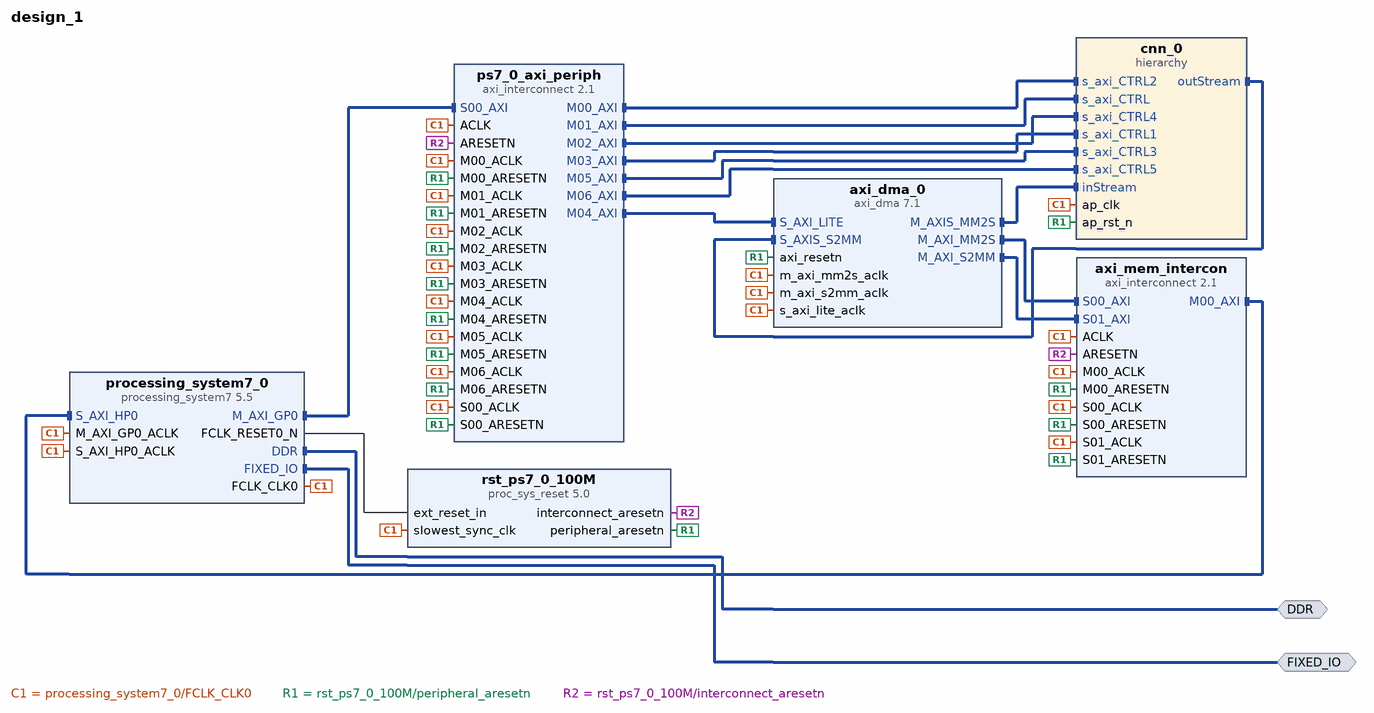
[diagram p0: block diagram of the top level]
# Vivado block design design_1, xc7z020clg484-1, Vivado 2016.4
create_bd_design design_1

create_bd_intf_port -mode Master -vlnv xilinx.com:interface:ddrx_rtl:1.0 DDR
create_bd_intf_port -mode Master -vlnv xilinx.com:display_processing_system7:fixedio_rtl:1.0 FIXED_IO

create_bd_cell -type ip -vlnv xilinx.com:ip:processing_system7:5.5 processing_system7_0
set_property -dict [list \
  CONFIG.PCW_USE_S_AXI_HP0 1 \
  CONFIG.PCW_USE_FABRIC_INTERRUPT 1 \
  CONFIG.PCW_IRQ_F2P_INTR 1 \
  CONFIG.preset ZedBoard \
] [get_bd_cells processing_system7_0]
create_bd_cell -type ip -vlnv xilinx.com:ip:axi_interconnect:2.1 ps7_0_axi_periph
set_property -dict {CONFIG.NUM_MI 7} [get_bd_cells ps7_0_axi_periph]
create_bd_cell -type ip -vlnv xilinx.com:ip:proc_sys_reset:5.0 rst_ps7_0_100M
create_bd_cell -type ip -vlnv xilinx.com:ip:axi_dma:7.1 axi_dma_0
set_property -dict [list \
  CONFIG.c_include_sg 0 \
  CONFIG.c_sg_length_width 23 \
  CONFIG.c_include_mm2s 1 \
  CONFIG.c_include_mm2s_dre 1 \
  CONFIG.c_include_s2mm_dre 1 \
] [get_bd_cells axi_dma_0]
create_bd_cell -type ip -vlnv xilinx.com:ip:axi_interconnect:2.1 axi_mem_intercon
set_property -dict {CONFIG.NUM_SI 2 CONFIG.NUM_MI 1} [get_bd_cells axi_mem_intercon]
create_bd_cell -type hier cnn_0

# ---- hierarchy /cnn_0 ----
current_bd_instance /cnn_0
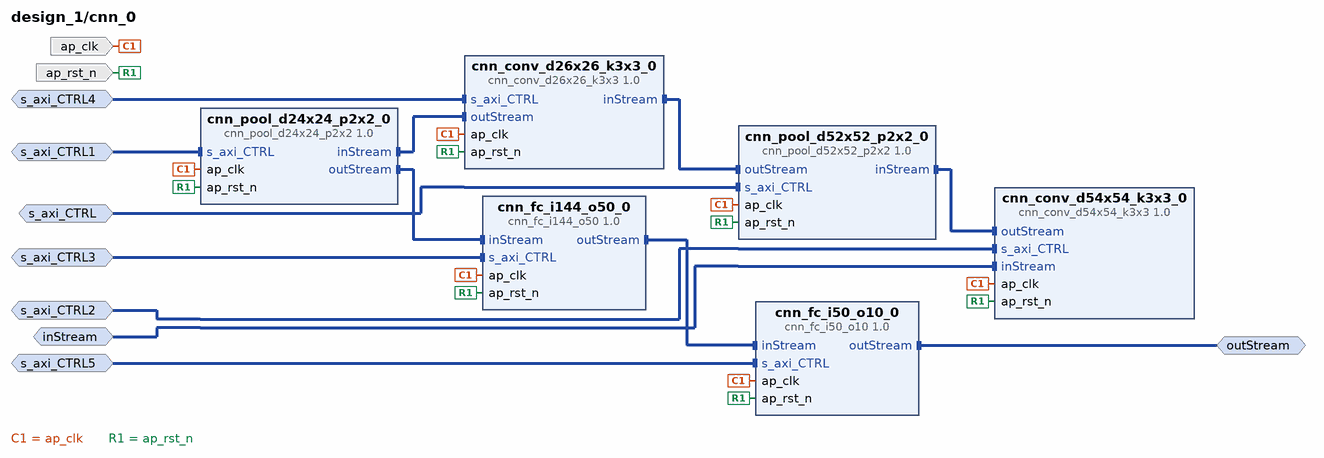
[diagram p1: block diagram inside /cnn_0]
create_bd_intf_pin -mode Slave -vlnv xilinx.com:interface:aximm_rtl:1.0 s_axi_CTRL
create_bd_intf_pin -mode Slave -vlnv xilinx.com:interface:aximm_rtl:1.0 s_axi_CTRL1
create_bd_intf_pin -mode Slave -vlnv xilinx.com:interface:aximm_rtl:1.0 s_axi_CTRL2
create_bd_intf_pin -mode Slave -vlnv xilinx.com:interface:axis_rtl:1.0 inStream
create_bd_intf_pin -mode Slave -vlnv xilinx.com:interface:aximm_rtl:1.0 s_axi_CTRL3
create_bd_intf_pin -mode Slave -vlnv xilinx.com:interface:aximm_rtl:1.0 s_axi_CTRL4
create_bd_intf_pin -mode Slave -vlnv xilinx.com:interface:aximm_rtl:1.0 s_axi_CTRL5
create_bd_intf_pin -mode Master -vlnv xilinx.com:interface:axis_rtl:1.0 outStream
create_bd_pin -dir I -type clk ap_clk
create_bd_pin -dir I -type rst ap_rst_n

create_bd_cell -type ip -vlnv xilinx.com:hls:cnn_pool_d52x52_p2x2:1.0 cnn_pool_d52x52_p2x2_0
create_bd_cell -type ip -vlnv xilinx.com:hls:cnn_pool_d24x24_p2x2:1.0 cnn_pool_d24x24_p2x2_0
create_bd_cell -type ip -vlnv xilinx.com:hls:cnn_conv_d54x54_k3x3:1.0 cnn_conv_d54x54_k3x3_0
create_bd_cell -type ip -vlnv xilinx.com:hls:cnn_fc_i144_o50:1.0 cnn_fc_i144_o50_0
create_bd_cell -type ip -vlnv xilinx.com:hls:cnn_conv_d26x26_k3x3:1.0 cnn_conv_d26x26_k3x3_0
create_bd_cell -type ip -vlnv xilinx.com:hls:cnn_fc_i50_o10:1.0 cnn_fc_i50_o10_0

# ---- connections ----

current_bd_instance /cnn_0
connect_bd_intf_net [get_bd_intf_pins cnn_pool_d52x52_p2x2_0/inStream] [get_bd_intf_pins cnn_conv_d54x54_k3x3_0/outStream]
connect_bd_intf_net [get_bd_intf_pins cnn_conv_d26x26_k3x3_0/inStream] [get_bd_intf_pins cnn_pool_d52x52_p2x2_0/outStream]
connect_bd_intf_net [get_bd_intf_pins cnn_pool_d24x24_p2x2_0/inStream] [get_bd_intf_pins cnn_conv_d26x26_k3x3_0/outStream]
connect_bd_intf_net [get_bd_intf_pins cnn_pool_d24x24_p2x2_0/outStream] [get_bd_intf_pins cnn_fc_i144_o50_0/inStream]
connect_bd_intf_net [get_bd_intf_pins cnn_fc_i144_o50_0/outStream] [get_bd_intf_pins cnn_fc_i50_o10_0/inStream]
connect_bd_intf_net [get_bd_intf_pins s_axi_CTRL] [get_bd_intf_pins cnn_pool_d52x52_p2x2_0/s_axi_CTRL]
connect_bd_intf_net [get_bd_intf_pins s_axi_CTRL1] [get_bd_intf_pins cnn_pool_d24x24_p2x2_0/s_axi_CTRL]
connect_bd_intf_net [get_bd_intf_pins s_axi_CTRL2] [get_bd_intf_pins cnn_conv_d54x54_k3x3_0/s_axi_CTRL]
connect_bd_intf_net -intf_net axi_dma_0_M_AXIS_MM2S [get_bd_intf_pins inStream] [get_bd_intf_pins cnn_conv_d54x54_k3x3_0/inStream]
connect_bd_intf_net [get_bd_intf_pins s_axi_CTRL3] [get_bd_intf_pins cnn_fc_i144_o50_0/s_axi_CTRL]
connect_bd_intf_net [get_bd_intf_pins s_axi_CTRL4] [get_bd_intf_pins cnn_conv_d26x26_k3x3_0/s_axi_CTRL]
connect_bd_intf_net [get_bd_intf_pins s_axi_CTRL5] [get_bd_intf_pins cnn_fc_i50_o10_0/s_axi_CTRL]
connect_bd_intf_net [get_bd_intf_pins outStream] [get_bd_intf_pins cnn_fc_i50_o10_0/outStream]
connect_bd_net -net processing_system7_0_FCLK_CLK0 [get_bd_pins ap_clk] \
  [get_bd_pins cnn_conv_d54x54_k3x3_0/ap_clk] [get_bd_pins cnn_conv_d26x26_k3x3_0/ap_clk] \
  [get_bd_pins cnn_pool_d24x24_p2x2_0/ap_clk] [get_bd_pins cnn_fc_i50_o10_0/ap_clk] [get_bd_pins cnn_fc_i144_o50_0/ap_clk] \
  [get_bd_pins cnn_pool_d52x52_p2x2_0/ap_clk]
connect_bd_net -net rst_ps7_0_100M_peripheral_aresetn [get_bd_pins ap_rst_n] \
  [get_bd_pins cnn_conv_d54x54_k3x3_0/ap_rst_n] [get_bd_pins cnn_conv_d26x26_k3x3_0/ap_rst_n] \
  [get_bd_pins cnn_pool_d24x24_p2x2_0/ap_rst_n] [get_bd_pins cnn_fc_i50_o10_0/ap_rst_n] \
  [get_bd_pins cnn_fc_i144_o50_0/ap_rst_n] [get_bd_pins cnn_pool_d52x52_p2x2_0/ap_rst_n]

current_bd_instance /
connect_bd_intf_net [get_bd_intf_pins ps7_0_axi_periph/M00_AXI] [get_bd_intf_pins cnn_0/s_axi_CTRL2]
connect_bd_intf_net [get_bd_intf_pins ps7_0_axi_periph/M01_AXI] [get_bd_intf_pins cnn_0/s_axi_CTRL]
connect_bd_intf_net [get_bd_intf_pins ps7_0_axi_periph/M02_AXI] [get_bd_intf_pins cnn_0/s_axi_CTRL4]
connect_bd_intf_net [get_bd_intf_pins ps7_0_axi_periph/M03_AXI] [get_bd_intf_pins cnn_0/s_axi_CTRL1]
connect_bd_intf_net [get_bd_intf_pins axi_dma_0/M_AXI_MM2S] [get_bd_intf_pins axi_mem_intercon/S00_AXI]
connect_bd_intf_net [get_bd_intf_pins axi_mem_intercon/M00_AXI] [get_bd_intf_pins processing_system7_0/S_AXI_HP0]
connect_bd_intf_net [get_bd_intf_pins ps7_0_axi_periph/M04_AXI] [get_bd_intf_pins axi_dma_0/S_AXI_LITE]
connect_bd_intf_net [get_bd_intf_pins axi_dma_0/M_AXI_S2MM] [get_bd_intf_pins axi_mem_intercon/S01_AXI]
connect_bd_intf_net [get_bd_intf_pins cnn_0/inStream] [get_bd_intf_pins axi_dma_0/M_AXIS_MM2S]
connect_bd_intf_net [get_bd_intf_pins ps7_0_axi_periph/M05_AXI] [get_bd_intf_pins cnn_0/s_axi_CTRL3]
connect_bd_intf_net [get_bd_intf_pins ps7_0_axi_periph/M06_AXI] [get_bd_intf_pins cnn_0/s_axi_CTRL5]
connect_bd_intf_net -intf_net cnn_fc_i50_o10_0_outStream [get_bd_intf_pins cnn_0/outStream] [get_bd_intf_pins axi_dma_0/S_AXIS_S2MM]
connect_bd_intf_net [get_bd_intf_pins processing_system7_0/M_AXI_GP0] [get_bd_intf_pins ps7_0_axi_periph/S00_AXI]
connect_bd_intf_net [get_bd_intf_ports DDR] [get_bd_intf_pins processing_system7_0/DDR]
connect_bd_intf_net [get_bd_intf_ports FIXED_IO] [get_bd_intf_pins processing_system7_0/FIXED_IO]
connect_bd_net [get_bd_pins processing_system7_0/FCLK_CLK0] \
  [get_bd_pins processing_system7_0/M_AXI_GP0_ACLK] [get_bd_pins rst_ps7_0_100M/slowest_sync_clk] \
  [get_bd_pins axi_dma_0/m_axi_mm2s_aclk] [get_bd_pins processing_system7_0/S_AXI_HP0_ACLK] \
  [get_bd_pins axi_dma_0/s_axi_lite_aclk] [get_bd_pins axi_dma_0/m_axi_s2mm_aclk] [get_bd_pins ps7_0_axi_periph/S00_ACLK] \
  [get_bd_pins ps7_0_axi_periph/ACLK] [get_bd_pins ps7_0_axi_periph/M00_ACLK] [get_bd_pins ps7_0_axi_periph/M01_ACLK] \
  [get_bd_pins ps7_0_axi_periph/M02_ACLK] [get_bd_pins ps7_0_axi_periph/M03_ACLK] [get_bd_pins axi_mem_intercon/S00_ACLK] \
  [get_bd_pins axi_mem_intercon/ACLK] [get_bd_pins axi_mem_intercon/M00_ACLK] [get_bd_pins ps7_0_axi_periph/M04_ACLK] \
  [get_bd_pins axi_mem_intercon/S01_ACLK] [get_bd_pins ps7_0_axi_periph/M05_ACLK] [get_bd_pins ps7_0_axi_periph/M06_ACLK] \
  [get_bd_pins cnn_0/ap_clk]
connect_bd_net [get_bd_pins processing_system7_0/FCLK_RESET0_N] [get_bd_pins rst_ps7_0_100M/ext_reset_in]
connect_bd_net [get_bd_pins rst_ps7_0_100M/peripheral_aresetn] \
  [get_bd_pins axi_dma_0/axi_resetn] [get_bd_pins ps7_0_axi_periph/S00_ARESETN] [get_bd_pins ps7_0_axi_periph/M00_ARESETN] \
  [get_bd_pins ps7_0_axi_periph/M01_ARESETN] [get_bd_pins ps7_0_axi_periph/M02_ARESETN] \
  [get_bd_pins ps7_0_axi_periph/M03_ARESETN] [get_bd_pins axi_mem_intercon/S00_ARESETN] \
  [get_bd_pins axi_mem_intercon/M00_ARESETN] [get_bd_pins ps7_0_axi_periph/M04_ARESETN] \
  [get_bd_pins axi_mem_intercon/S01_ARESETN] [get_bd_pins ps7_0_axi_periph/M05_ARESETN] \
  [get_bd_pins ps7_0_axi_periph/M06_ARESETN] [get_bd_pins cnn_0/ap_rst_n]
connect_bd_net [get_bd_pins rst_ps7_0_100M/interconnect_aresetn] [get_bd_pins ps7_0_axi_periph/ARESETN] [get_bd_pins axi_mem_intercon/ARESETN]

# ---- address map ----
assign_bd_address -offset 0x00000000 -range 512M -target_address_space [get_bd_addr_spaces axi_dma_0/Data_MM2S] [get_bd_addr_segs processing_system7_0/S_AXI_HP0/HP0_DDR_LOWOCM]
assign_bd_address -offset 0x00000000 -range 512M -target_address_space [get_bd_addr_spaces axi_dma_0/Data_S2MM] [get_bd_addr_segs processing_system7_0/S_AXI_HP0/HP0_DDR_LOWOCM]
assign_bd_address -offset 0x40400000 -range 64K -target_address_space [get_bd_addr_spaces processing_system7_0/Data] [get_bd_addr_segs axi_dma_0/S_AXI_LITE/Reg]
assign_bd_address -offset 0x43C00000 -range 64K -target_address_space [get_bd_addr_spaces processing_system7_0/Data] [get_bd_addr_segs cnn_0/cnn_conv_d26x26_k3x3_0/s_axi_CTRL/Reg]
assign_bd_address -offset 0x43C10000 -range 64K -target_address_space [get_bd_addr_spaces processing_system7_0/Data] [get_bd_addr_segs cnn_0/cnn_conv_d54x54_k3x3_0/s_axi_CTRL/Reg]
assign_bd_address -offset 0x43C20000 -range 64K -target_address_space [get_bd_addr_spaces processing_system7_0/Data] [get_bd_addr_segs cnn_0/cnn_fc_i144_o50_0/s_axi_CTRL/Reg]
assign_bd_address -offset 0x43C30000 -range 64K -target_address_space [get_bd_addr_spaces processing_system7_0/Data] [get_bd_addr_segs cnn_0/cnn_fc_i50_o10_0/s_axi_CTRL/Reg]
assign_bd_address -offset 0x43C40000 -range 64K -target_address_space [get_bd_addr_spaces processing_system7_0/Data] [get_bd_addr_segs cnn_0/cnn_pool_d24x24_p2x2_0/s_axi_CTRL/Reg]
assign_bd_address -offset 0x43C50000 -range 64K -target_address_space [get_bd_addr_spaces processing_system7_0/Data] [get_bd_addr_segs cnn_0/cnn_pool_d52x52_p2x2_0/s_axi_CTRL/Reg]

validate_bd_design
save_bd_design
